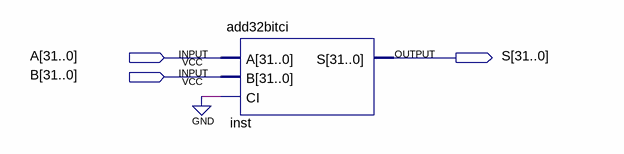
[diagram p0: schematic sheet]
// Quartus schematic add32bit.bdf as structural Verilog: 1 symbols, 3 pins
module add32bit (
  input  [31:0] A,
  input  [31:0] B,
  output [31:0] S
);

  add32bitci inst (.A(A), .B(B), .CI(1'b0), .S(S));
endmodule
